# Altium schematic sheet Copy of STM32_F407.SchDoc.schdoc
size 576 x 409 mm
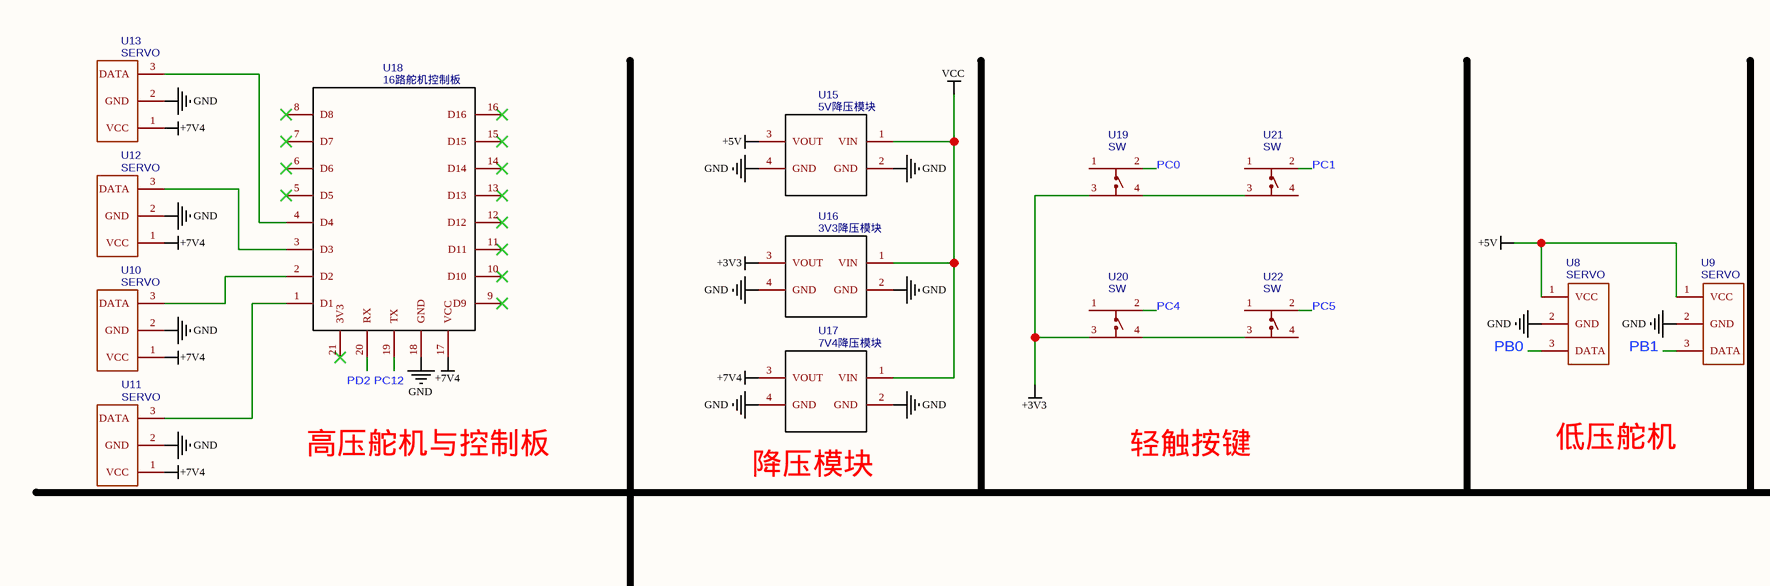
[diagram p0: Copy of STM32_F407.SchDoc.schdoc, top left]
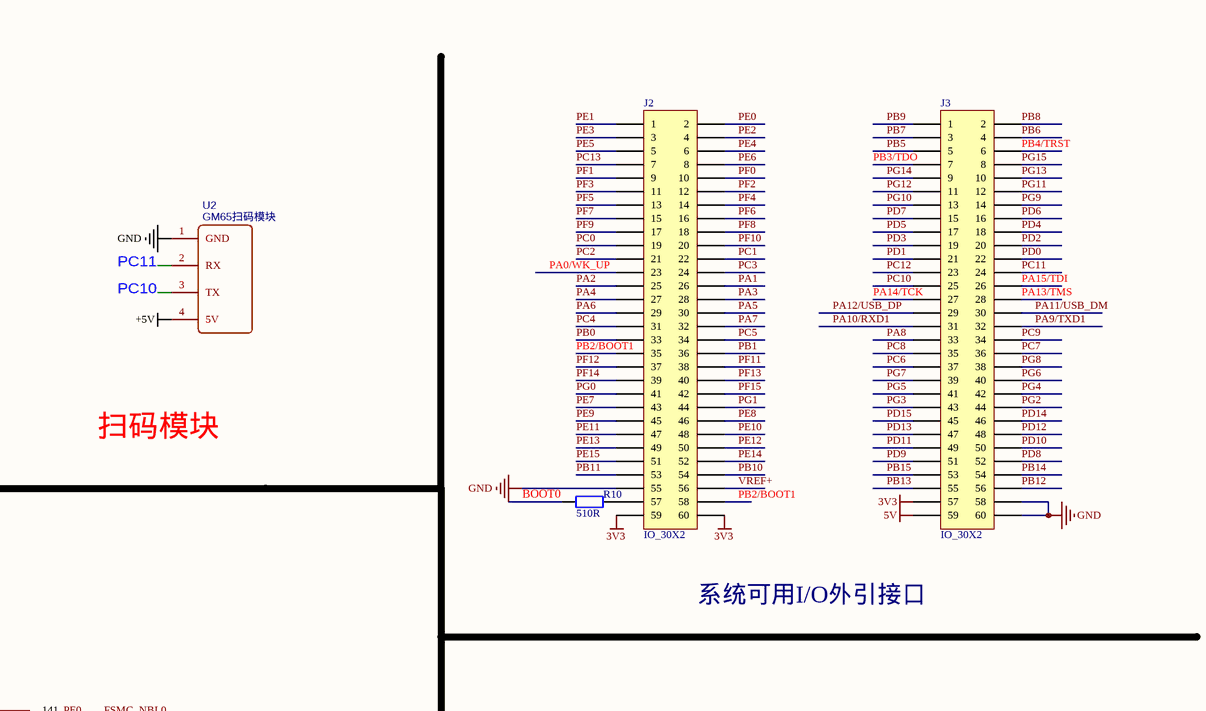
[diagram p1: Copy of STM32_F407.SchDoc.schdoc, top right]
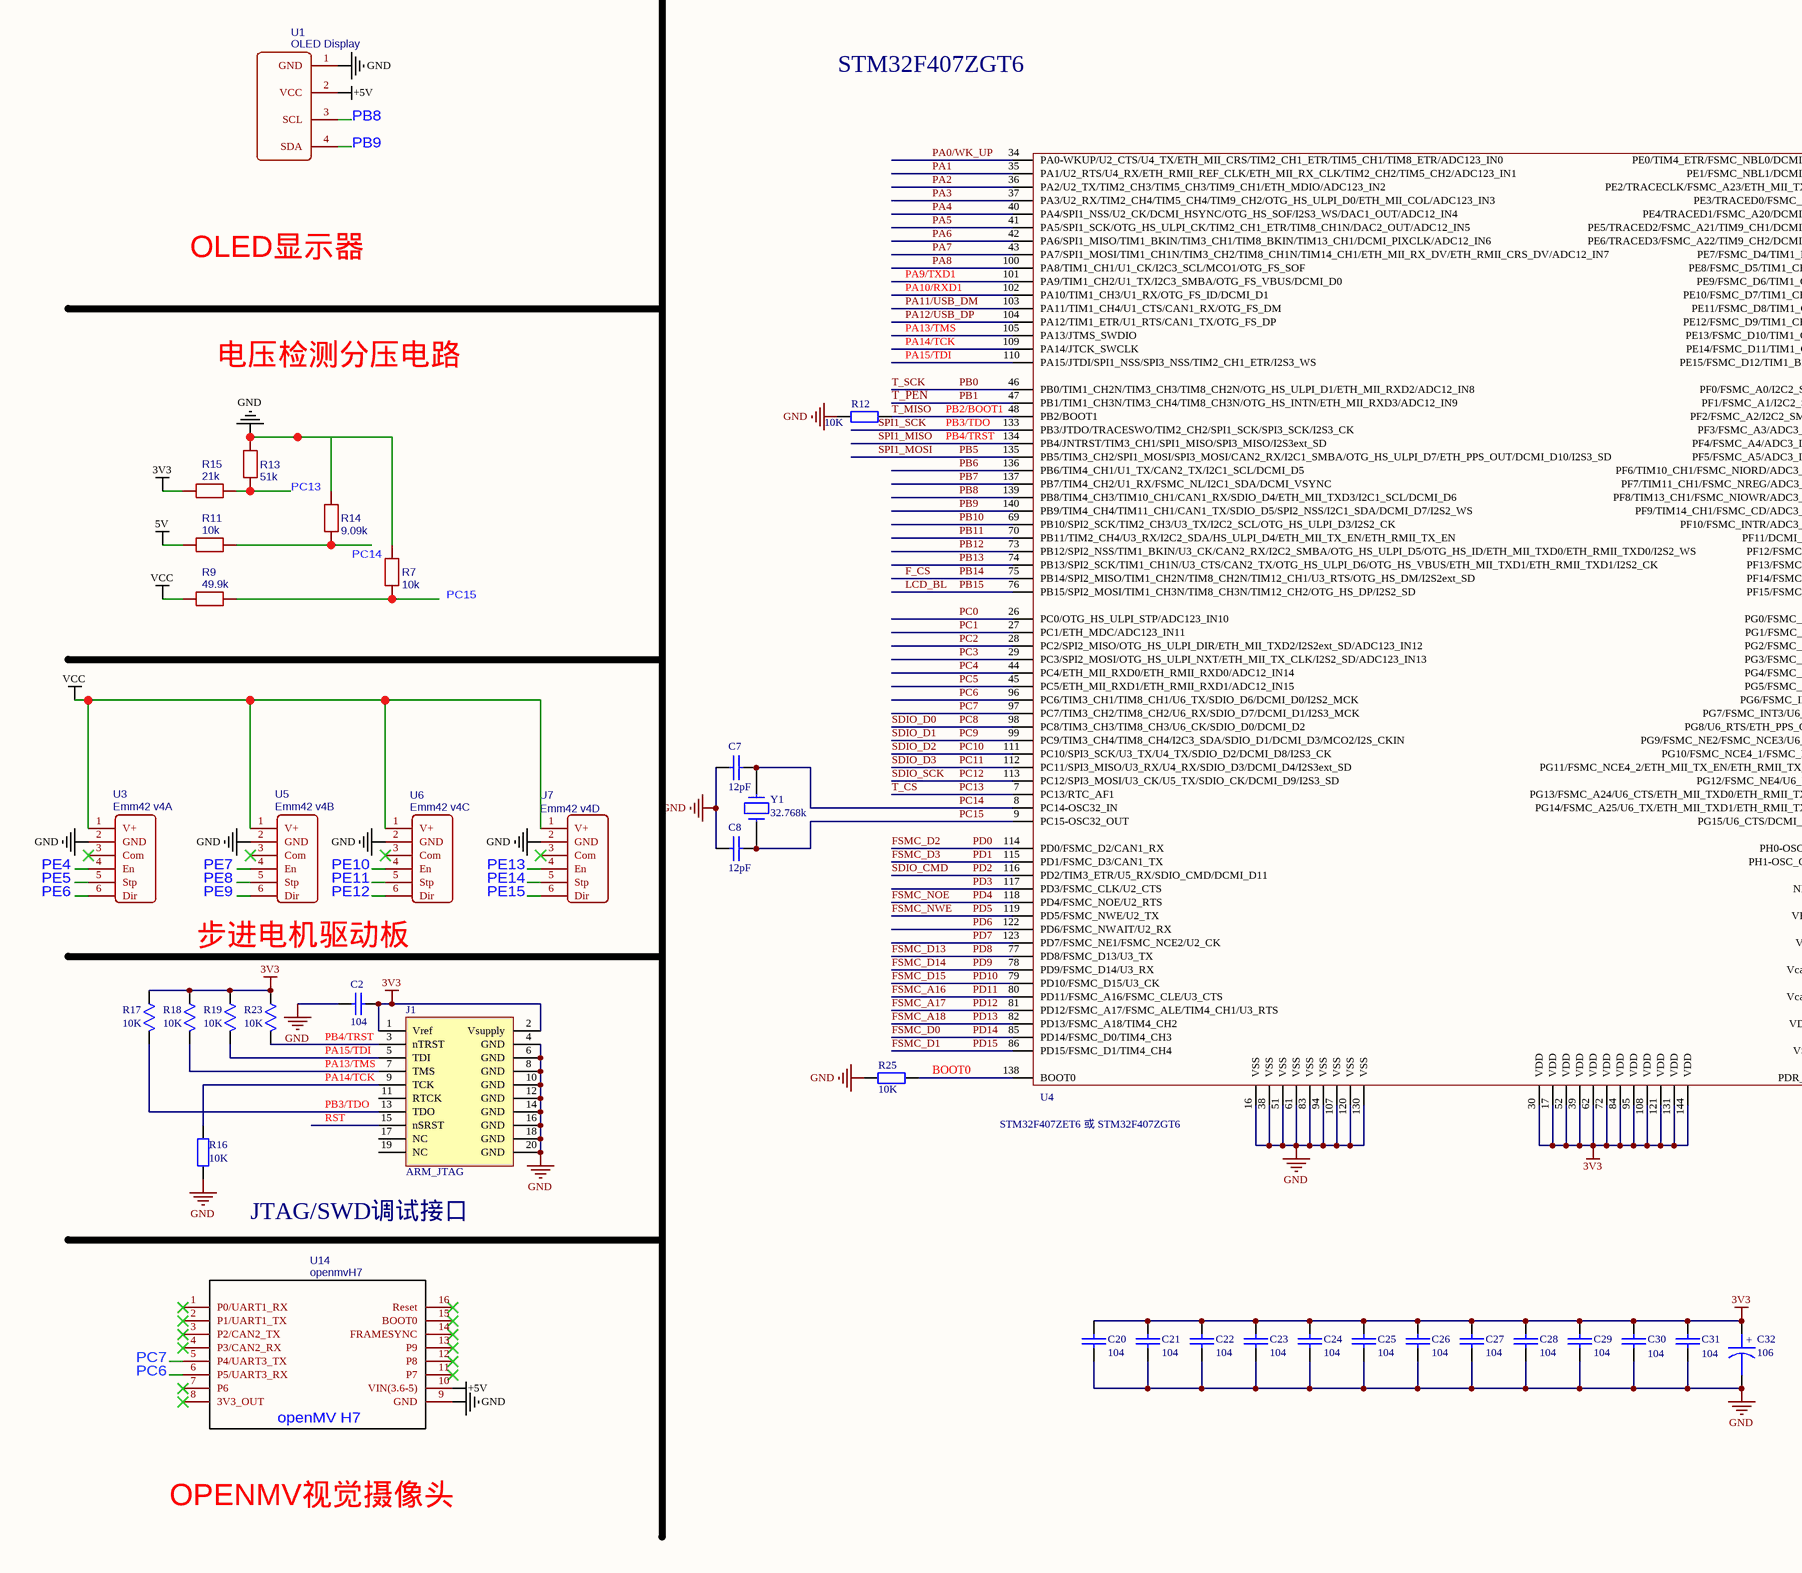
[diagram p2: Copy of STM32_F407.SchDoc.schdoc, bottom left]
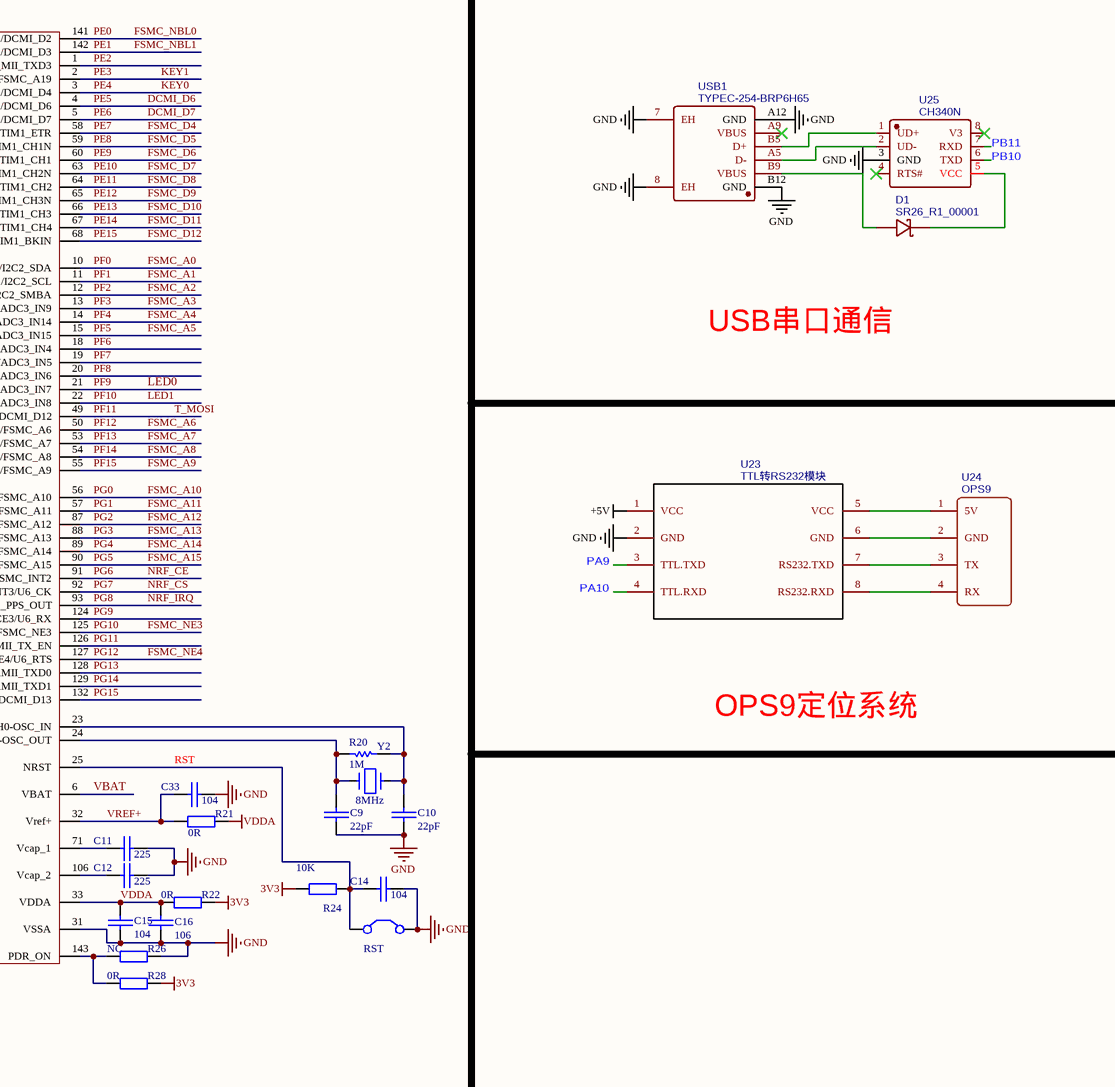
[diagram p3: Copy of STM32_F407.SchDoc.schdoc, bottom right]

## Parts
C2  NO  [RC0603]  (value not drawn)
C7  12pF  [RC0603]
C8  12pF  [RC0603]
C9  22pF  [RC0603]
C10  22pF  [RC0603]
C11  225  [RC0805]
C12  225  [RC0805]
C14  104  [RC0603]
C15  104  [RC0603]
C16  106  [RC0805]
C20  104  [RC0603]
C21  104  [RC0603]
C22  104  [RC0603]
C23  104  [RC0603]
C24  104  [RC0603]
C25  104  [RC0603]
C26  104  [RC0603]
C27  104  [RC0603]
C28  104  [RC0603]
C29  104  [RC0603]
C30  104  [RC0603]
C31  104  [RC0603]
C32  106  [RC0805]
C33  104  [RC0603]
D1  SR26_R1_00001  [SMA_L4.3-W2.6-LS5.2-RD]
J1  ARM_JTAG  [JTAG20P]
J2  IO_30X2  [IDE2X30]
J3  IO_30X2  [IDE2X30]
R7  10k  [R0805]
R9  49.9k  [R0805]
R10  510R  [RC0603]
R11  10k  [R0805]
R12  10K  [RC0603]
R13  51k  [R0805]
R14  9.09k  [R0603]
R15  21k  [R0603]
R16  10K  [RC0603]
R17  10K  [RC0603]
R18  10K  [RC0603]
R19  10K  [RC0603]
R20  1M  [RC0603]
R21  0R  [RC0603]
R22  0R  [RC0603]
R23  10K  [RC0603]
R24  10K  [RC0603]
R25  10K  [RC0603]
R26  NC  [RC0603]
R28  0R  [RC0603]
RST  Key  [KEY]  (value not drawn)
U1  OLED Display
U2  GM65扫码模块
U3  Emm42 v4A
U4  STM32F407ZET6 或 STM32F407ZGT6  [LQFP144N]
U5  Emm42 v4B
U6  Emm42 v4C
U7  Emm42 v4D
U8  SERVO
U9  SERVO
U10  SERVO
U11  SERVO
U12  SERVO
U13  SERVO
U14  openmvH7  [OPENMVH7]
U15  5V降压模块
U16  3V3降压模块
U17  7V4降压模块
U18  16路舵机控制板
U19  SW  [SW-SMD_4P-L6.0-W6.0-P4.50-LS9.0-2]
U20  SW  [SW-SMD_4P-L6.0-W6.0-P4.50-LS9.0-2]
U21  SW  [SW-SMD_4P-L6.0-W6.0-P4.50-LS9.0-2]
U22  SW  [SW-SMD_4P-L6.0-W6.0-P4.50-LS9.0-2]
U23  TTL转RS232模块
U24  OPS9
U25  CH340N  [SOP-8_L5.0-W4.0-P1.27-LS6.0-BL]
USB1  TYPEC-254-BRP6H65  [USB-C-SMD_TYPEC-254-BRP6H65]
Y1  8MHz  [32.768K]  (value not drawn)
Y2  8MHz  [SMD49S]

## Nets
3V3: C2.2 C20.1 C21.1 C22.1 C23.1 C24.1 C25.1 C26.1 C27.1 C28.1 C29.1 C30.1 C31.1 C32.1 J1.1(Vref) J1.2(Vsupply) J2.59 J2.60 J3.57 R15.1 R17.1 R18.1 R19.1 R22.2 R23.1 R24.2 R28.2 U4.17(VDD) U4.30(VDD) U4.39(VDD) U4.52(VDD) U4.62(VDD) U4.72(VDD) U4.84(VDD) U4.95(VDD) U4.108(VDD) U4.121(VDD) U4.131(VDD) U4.144(VDD)
5V: J3.59 R11.1
+3V3: U16.3(VOUT) U19.3(C) U20.3(C)
+5V: U1.2(VCC) U2.4(5V) U8.1(VCC) U9.1(VCC) U14.10(VIN(3.6-5)) U15.3(VOUT) U23.1(VCC)
+7V4: U10.1(VCC) U11.1(VCC) U12.1(VCC) U13.1(VCC) U17.3(VOUT) U18.17(VCC)
GND: C2.1 C7.1 C8.1 C9.2 C10.2 C11.2 C12.2 C14.1 C15.1 C16.1 C20.2 C21.2 C22.2 C23.2 C24.2 C25.2 C26.2 C27.2 C28.2 C29.2 C30.2 C31.2 C32.2 C33.2 J1.4(GND) J1.6(GND) J1.8(GND) J1.10(GND) J1.12(GND) J1.14(GND) J1.16(GND) J1.18(GND) J1.20(GND) J2.55 J3.58 J3.60 R7.2 R12.2 R13.2 R14.2 R16.1 R25.2 R26.2 RST.2(C2) U1.1(GND) U2.1(GND) U3.2(GND) U4.16(VSS) U4.31(VSSA) U4.38(VSS) U4.51(VSS) U4.61(VSS) U4.83(VSS) U4.94(VSS) U4.107(VSS) U4.120(VSS) U4.130(VSS) U5.2(GND) U6.2(GND) U7.2(GND) U8.2(GND) U9.2(GND) U10.2(GND) U11.2(GND) U12.2(GND) U13.2(GND) U14.9(GND) U15.2(GND) U15.4(GND) U16.2(GND) U16.4(GND) U17.2(GND) U17.4(GND) U18.18(GND) U23.2(GND) U25.3(GND) USB1.7(EH) USB1.8(EH) USB1.A12(GND) USB1.B12(GND)
VCC: R9.1 U3.1(V+) U5.1(V+) U6.1(V+) U7.1(V+) U15.1(VIN) U16.1(VIN) U17.1(VIN)
VDDA: C15.2 C16.2 R21.2 R22.1 U4.33(VDDA)
BOOT0: R10.2 R25.1 U4.138(BOOT0)
DCMI_D6: J2.5 U4.4(PE5/TRACED2/FSMC_A21/TIM9_CH1/DCMI_D6)  [also labelled PE5]
DCMI_D7: J2.8 U4.5(PE6/TRACED3/FSMC_A22/TIM9_CH2/DCMI_D7)  [also labelled PE6]
F_CS: J3.54 U4.75(PB14/SPI2_MISO/TIM1_CH2N/TIM8_CH2N/TIM12_CH1/U3_RTS/OTG_HS_DM/I2S2ext_SD)  [also labelled PB14]
FSMC_A0: J2.10 U4.10(PF0/FSMC_A0/I2C2_SDA)  [also labelled PF0]
FSMC_A1: J2.9 U4.11(PF1/FSMC_A1/I2C2_SCL)  [also labelled PF1]
FSMC_A2: J2.12 U4.12(PF2/FSMC_A2/I2C2_SMBA)  [also labelled PF2]
FSMC_A3: J2.11 U4.13(PF3/FSMC_A3/ADC3_IN9)  [also labelled PF3]
FSMC_A4: J2.14 U4.14(PF4/FSMC_A4/ADC3_IN14)  [also labelled PF4]
FSMC_A5: J2.13 U4.15(PF5/FSMC_A5/ADC3_IN15)  [also labelled PF5]
FSMC_A6: J2.37 U4.50(PF12/FSMC_A6)  [also labelled PF12]
FSMC_A7: J2.40 U4.53(PF13/FSMC_A7)  [also labelled PF13]
FSMC_A8: J2.39 U4.54(PF14/FSMC_A8)  [also labelled PF14]
FSMC_A9: J2.42 U4.55(PF15/FSMC_A9)  [also labelled PF15]
FSMC_A10: J2.41 U4.56(PG0/FSMC_A10)  [also labelled PG0]
FSMC_A11: J2.44 U4.57(PG1/FSMC_A11)  [also labelled PG1]
FSMC_A12: J3.44 U4.87(PG2/FSMC_A12)  [also labelled PG2]
FSMC_A13: J3.43 U4.88(PG3/FSMC_A13)  [also labelled PG3]
FSMC_A14: J3.42 U4.89(PG4/FSMC_A14)  [also labelled PG4]
FSMC_A15: J3.41 U4.90(PG5/FSMC_A15)  [also labelled PG5]
FSMC_A16: J3.49 U4.80(PD11/FSMC_A16/FSMC_CLE/U3_CTS)  [also labelled PD11]
FSMC_A17: J3.48 U4.81(PD12/FSMC_A17/FSMC_ALE/TIM4_CH1/U3_RTS)  [also labelled PD12]
FSMC_A18: J3.47 U4.82(PD13/FSMC_A18/TIM4_CH2)  [also labelled PD13]
FSMC_D0: J3.46 U4.85(PD14/FSMC_D0/TIM4_CH3)  [also labelled PD14]
FSMC_D1: J3.45 U4.86(PD15/FSMC_D1/TIM4_CH4)  [also labelled PD15]
FSMC_D2: J3.22 U4.114(PD0/FSMC_D2/CAN1_RX)  [also labelled PD0]
FSMC_D3: J3.21 U4.115(PD1/FSMC_D3/CAN1_TX)  [also labelled PD1]
FSMC_D4: J2.43 U4.58(PE7/FSMC_D4/TIM1_ETR)  [also labelled PE7]
FSMC_D5: J2.46 U4.59(PE8/FSMC_D5/TIM1_CH1N)  [also labelled PE8]
FSMC_D6: J2.45 U4.60(PE9/FSMC_D6/TIM1_CH1)  [also labelled PE9]
FSMC_D7: J2.48 U4.63(PE10/FSMC_D7/TIM1_CH2N)  [also labelled PE10]
FSMC_D8: J2.47 U4.64(PE11/FSMC_D8/TIM1_CH2)  [also labelled PE11]
FSMC_D9: J2.50 U4.65(PE12/FSMC_D9/TIM1_CH3N)  [also labelled PE12]
FSMC_D10: J2.49 U4.66(PE13/FSMC_D10/TIM1_CH3)  [also labelled PE13]
FSMC_D11: J2.52 U4.67(PE14/FSMC_D11/TIM1_CH4)  [also labelled PE14]
FSMC_D12: J2.51 U4.68(PE15/FSMC_D12/TIM1_BKIN)  [also labelled PE15]
FSMC_D13: J3.52 U4.77(PD8/FSMC_D13/U3_TX)  [also labelled PD8]
FSMC_D14: J3.51 U4.78(PD9/FSMC_D14/U3_RX)  [also labelled PD9]
FSMC_D15: J3.50 U4.79(PD10/FSMC_D15/U3_CK)  [also labelled PD10]
FSMC_NBL0: J2.2 U4.141(PE0/TIM4_ETR/FSMC_NBL0/DCMI_D2)  [also labelled PE0]
FSMC_NBL1: J2.1 U4.142(PE1/FSMC_NBL1/DCMI_D3)  [also labelled PE1]
FSMC_NE3: J3.13 U4.125(PG10/FSMC_NCE4_1/FSMC_NE3)  [also labelled PG10]
FSMC_NE4: J3.11 U4.127(PG12/FSMC_NE4/U6_RTS)  [also labelled PG12]
FSMC_NOE: J3.18 U4.118(PD4/FSMC_NOE/U2_RTS)  [also labelled PD4]
FSMC_NWE: J3.17 U4.119(PD5/FSMC_NWE/U2_TX)  [also labelled PD5]
KEY0: J2.6 U4.3(PE4/TRACED1/FSMC_A20/DCMI_D4)  [also labelled PE4]
KEY1: J2.3 U4.2(PE3/TRACED0/FSMC_A19)  [also labelled PE3]
LCD_BL: J3.53 U4.76(PB15/SPI2_MOSI/TIM1_CH3N/TIM8_CH3N/TIM12_CH2/OTG_HS_DP/I2S2_SD)  [also labelled PB15]
LED0: J2.17 U4.21(PF9/TIM14_CH1/FSMC_CD/ADC3_IN7)  [also labelled PF9]
LED1: J2.20 U4.22(PF10/FSMC_INTR/ADC3_IN8)  [also labelled PF10]
NRF_CE: J3.40 U4.91(PG6/FSMC_INT2)  [also labelled PG6]
NRF_CS: J3.39 U4.92(PG7/FSMC_INT3/U6_CK)  [also labelled PG7]
NRF_IRQ: J3.38 U4.93(PG8/U6_RTS/ETH_PPS_OUT)  [also labelled PG8]
PA0/WK_UP: J2.23 U4.34(PA0-WKUP/U2_CTS/U4_TX/ETH_MII_CRS/TIM2_CH1_ETR/TIM5_CH1/TIM8_ETR/ADC123_IN0)
PA1: J2.26 U4.35(PA1/U2_RTS/U4_RX/ETH_RMII_REF_CLK/ETH_MII_RX_CLK/TIM2_CH2/TIM5_CH2/ADC123_IN1)
PA2: J2.25 U4.36(PA2/U2_TX/TIM2_CH3/TIM5_CH3/TIM9_CH1/ETH_MDIO/ADC123_IN2)
PA3: J2.28 U4.37(PA3/U2_RX/TIM2_CH4/TIM5_CH4/TIM9_CH2/OTG_HS_ULPI_D0/ETH_MII_COL/ADC123_IN3)
PA4: J2.27 U4.40(PA4/SPI1_NSS/U2_CK/DCMI_HSYNC/OTG_HS_SOF/I2S3_WS/DAC1_OUT/ADC12_IN4)
PA5: J2.30 U4.41(PA5/SPI1_SCK/OTG_HS_ULPI_CK/TIM2_CH1_ETR/TIM8_CH1N/DAC2_OUT/ADC12_IN5)
PA6: J2.29 U4.42(PA6/SPI1_MISO/TIM1_BKIN/TIM3_CH1/TIM8_BKIN/TIM13_CH1/DCMI_PIXCLK/ADC12_IN6)
PA7: J2.32 U4.43(PA7/SPI1_MOSI/TIM1_CH1N/TIM3_CH2/TIM8_CH1N/TIM14_CH1/ETH_MII_RX_DV/ETH_RMII_CRS_DV/ADC12_IN7)
PA8: J3.33 U4.100(PA8/TIM1_CH1/U1_CK/I2C3_SCL/MCO1/OTG_FS_SOF)
PA9/TXD1: J3.32 U4.101(PA9/TIM1_CH2/U1_TX/I2C3_SMBA/OTG_FS_VBUS/DCMI_D0)
PA10/RXD1: J3.31 U4.102(PA10/TIM1_CH3/U1_RX/OTG_FS_ID/DCMI_D1)
PA11/USB_DM: J3.30 U4.103(PA11/TIM1_CH4/U1_CTS/CAN1_RX/OTG_FS_DM)
PA12/USB_DP: J3.29 U4.104(PA12/TIM1_ETR/U1_RTS/CAN1_TX/OTG_FS_DP)
PA13/TMS: J1.7(TMS) J3.28 R18.2 U4.105(PA13/JTMS_SWDIO)
PA14/TCK: J1.9(TCK) J3.27 R16.2 U4.109(PA14/JTCK_SWCLK)
PA15/TDI: J1.5(TDI) J3.26 R19.2 U4.110(PA15/JTDI/SPI1_NSS/SPI3_NSS/TIM2_CH1_ETR/I2S3_WS)
PB0: J2.33 U4.46(PB0/TIM1_CH2N/TIM3_CH3/TIM8_CH2N/OTG_HS_ULPI_D1/ETH_MII_RXD2/ADC12_IN8)  [also labelled T_SCK]
PB1: J2.36 U4.47(PB1/TIM1_CH3N/TIM3_CH4/TIM8_CH3N/OTG_HS_INTN/ETH_MII_RXD3/ADC12_IN9)  [also labelled T_PEN]
PB2/BOOT1: J2.35 J2.58 R12.1 U4.48(PB2/BOOT1)  [also labelled T_MISO]
PB3/TDO: J1.13(TDO) J3.7 R17.2 U4.133(PB3/JTDO/TRACESWO/TIM2_CH2/SPI1_SCK/SPI3_SCK/I2S3_CK)  [also labelled SPI1_SCK]
PB4/TRST: J1.3(nTRST) J3.6 R23.2 U4.134(PB4/JNTRST/TIM3_CH1/SPI1_MISO/SPI3_MISO/I2S3ext_SD)  [also labelled SPI1_MISO]
PB5: J3.5 U4.135(PB5/TIM3_CH2/SPI1_MOSI/SPI3_MOSI/CAN2_RX/I2C1_SMBA/OTG_HS_ULPI_D7/ETH_PPS_OUT/DCMI_D10/I2S3_SD)  [also labelled SPI1_MOSI]
PB6: J3.4 U4.136(PB6/TIM4_CH1/U1_TX/CAN2_TX/I2C1_SCL/DCMI_D5)
PB7: J3.3 U4.137(PB7/TIM4_CH2/U1_RX/FSMC_NL/I2C1_SDA/DCMI_VSYNC)
PB8: J3.2 U4.139(PB8/TIM4_CH3/TIM10_CH1/CAN1_RX/SDIO_D4/ETH_MII_TXD3/I2C1_SCL/DCMI_D6)
PB9: J3.1 U4.140(PB9/TIM4_CH4/TIM11_CH1/CAN1_TX/SDIO_D5/SPI2_NSS/I2C1_SDA/DCMI_D7/I2S2_WS)
PB10: J2.54 U4.69(PB10/SPI2_SCK/TIM2_CH3/U3_TX/I2C2_SCL/OTG_HS_ULPI_D3/I2S2_CK)
PB11: J2.53 U4.70(PB11/TIM2_CH4/U3_RX/I2C2_SDA/HS_ULPI_D4/ETH_MII_TX_EN/ETH_RMII_TX_EN)
PB12: J3.56 U4.73(PB12/SPI2_NSS/TIM1_BKIN/U3_CK/CAN2_RX/I2C2_SMBA/OTG_HS_ULPI_D5/OTG_HS_ID/ETH_MII_TXD0/ETH_RMII_TXD0/I2S2_WS)
PB13: J3.55 U4.74(PB13/SPI2_SCK/TIM1_CH1N/U3_CTS/CAN2_TX/OTG_HS_ULPI_D6/OTG_HS_VBUS/ETH_MII_TXD1/ETH_RMII_TXD1/I2S2_CK)
PC0: J2.19 U4.26(PC0/OTG_HS_ULPI_STP/ADC123_IN10)
PC1: J2.22 U4.27(PC1/ETH_MDC/ADC123_IN11)
PC2: J2.21 U4.28(PC2/SPI2_MISO/OTG_HS_ULPI_DIR/ETH_MII_TXD2/I2S2ext_SD/ADC123_IN12)
PC3: J2.24 U4.29(PC3/SPI2_MOSI/OTG_HS_ULPI_NXT/ETH_MII_TX_CLK/I2S2_SD/ADC123_IN13)
PC4: J2.31 U4.44(PC4/ETH_MII_RXD0/ETH_RMII_RXD0/ADC12_IN14)
PC5: J2.34 U4.45(PC5/ETH_MII_RXD1/ETH_RMII_RXD1/ADC12_IN15)
PC6: J3.37 U4.96(PC6/TIM3_CH1/TIM8_CH1/U6_TX/SDIO_D6/DCMI_D0/I2S2_MCK)
PC7: J3.36 U4.97(PC7/TIM3_CH2/TIM8_CH2/U6_RX/SDIO_D7/DCMI_D1/I2S3_MCK)
PC8: J3.35 U4.98(PC8/TIM3_CH3/TIM8_CH3/U6_CK/SDIO_D0/DCMI_D2)  [also labelled SDIO_D0]
PC9: J3.34 U4.99(PC9/TIM3_CH4/TIM8_CH4/I2C3_SDA/SDIO_D1/DCMI_D3/MCO2/I2S_CKIN)  [also labelled SDIO_D1]
PC10: J3.25 U4.111(PC10/SPI3_SCK/U3_TX/U4_TX/SDIO_D2/DCMI_D8/I2S3_CK)  [also labelled SDIO_D2]
PC11: J3.24 U4.112(PC11/SPI3_MISO/U3_RX/U4_RX/SDIO_D3/DCMI_D4/I2S3ext_SD)  [also labelled SDIO_D3]
PC12: J3.23 U4.113(PC12/SPI3_MOSI/U3_CK/U5_TX/SDIO_CK/DCMI_D9/I2S3_SD)  [also labelled SDIO_SCK]
PC13: J2.7 U4.7(PC13/RTC_AF1)  [also labelled T_CS]
PC14: C7.2 U4.8(PC14-OSC32_IN) Y1.2
PC15: C8.2 U4.9(PC15-OSC32_OUT) Y1.1
PD2: J3.20 U4.116(PD2/TIM3_ETR/U5_RX/SDIO_CMD/DCMI_D11)  [also labelled SDIO_CMD]
PD3: J3.19 U4.117(PD3/FSMC_CLK/U2_CTS)
PD6: J3.16 U4.122(PD6/FSMC_NWAIT/U2_RX)
PD7: J3.15 U4.123(PD7/FSMC_NE1/FSMC_NCE2/U2_CK)
PE2: J2.4 U4.1(PE2/TRACECLK/FSMC_A23/ETH_MII_TXD3)
PF6: J2.16 U4.18(PF6/TIM10_CH1/FSMC_NIORD/ADC3_IN4)
PF7: J2.15 U4.19(PF7/TIM11_CH1/FSMC_NREG/ADC3_IN5)
PF8: J2.18 U4.20(PF8/TIM13_CH1/FSMC_NIOWR/ADC3_IN6)
PF11: J2.38 U4.49(PF11/DCMI_D12)  [also labelled T_MOSI]
PG9: J3.14 U4.124(PG9/FSMC_NE2/FSMC_NCE3/U6_RX)
PG11: J3.12 U4.126(PG11/FSMC_NCE4_2/ETH_MII_TX_EN/ETH_RMII_TX_EN)
PG13: J3.10 U4.128(PG13/FSMC_A24/U6_CTS/ETH_MII_TXD0/ETH_RMII_TXD0)
PG14: J3.9 U4.129(PG14/FSMC_A25/U6_TX/ETH_MII_TXD1/ETH_RMII_TXD1)
PG15: J3.8 U4.132(PG15/U6_CTS/DCMI_D13)
RST: C14.2 J1.15(nSRST) R24.1 RST.1(C1) U4.25(NRST)
VBAT: U4.6(VBAT)
VREF+: C33.1 J2.56 R21.1 U4.32(Vref+)
NetC9_1: C9.1 R20.2 U4.24(PH1-OSC_OUT) Y2.2
NetC10_1: C10.1 R20.1 U4.23(PH0-OSC_IN) Y2.1
NetC11_1: C11.1 U4.71(Vcap_1)
NetC12_1: C12.1 U4.106(Vcap_2)
NetD1_1: D1.1 U25.5(VCC)
NetD1_2: D1.2 USB1.B9(VBUS)
NetJ2_57: J2.57 R10.1
NetR7_1: R7.1 R9.2
NetR11_2: R11.2 R14.1
NetR13_1: R13.1 R15.2
NetR26_1: R26.1 R28.1 U4.143(PDR_ON)
NetU10_3: U10.3(DATA) U18.2(D2)
NetU11_3: U11.3(DATA) U18.1(D1)
NetU12_3: U12.3(DATA) U18.3(D3)
NetU13_3: U13.3(DATA) U18.4(D4)
NetU19_4: U19.4(D) U21.3(C)
NetU20_4: U20.4(D) U22.3(C)
NetU23_5: U23.5(VCC) U24.1(5V)
NetU23_6: U23.6(GND) U24.2(GND)
NetU23_7: U23.7(RS232.TXD) U24.3(TX)
NetU23_8: U23.8(RS232.RXD) U24.4(RX)
NetU25_1: U25.1(UD+) USB1.B5(D+)
NetU25_2: U25.2(UD-) USB1.A5(D-)

Not connected (* = marked no-connect by the designer): J1 11(RTCK) 17(NC) 19(NC); U1 3(SCL) 4(SDA); U2 2(RX) 3(TX); U3 3(Com)* 4(En) 5(Stp) 6(Dir); U5 3(Com)* 4(En) 5(Stp) 6(Dir); U6 3(Com)* 4(En) 5(Stp) 6(Dir); U7 3(Com)* 4(En) 5(Stp) 6(Dir); U8 3(DATA); U9 3(DATA); U14 1(P0/UART1_RX)* 2(P1/UART1_TX)* 3(P2/CAN2_TX)* 4(P3/CAN2_RX)* 5(P4/UART3_TX) 6(P5/UART3_RX) 7(P6)* 8(3V3_OUT)* 11(P7)* 12(P8)* 13(P9)* 14(FRAMESYNC)* 15(BOOT0)* 16(Reset)*; U18 5(D5)* 6(D6)* 7(D7)* 8(D8)* 9(D9)* 10(D10)* 11(D11)* 12(D12)* 13(D13)* 14(D14)* 15(D15)* 16(D16)* 19(TX) 20(RX) 21(3V3)*; U19 1(A) 2(B); U20 1(A) 2(B); U21 1(A) 2(B) 4(D); U22 1(A) 2(B) 4(D); U23 3(TTL.TXD) 4(TTL.RXD); U25 4(RTS#)* 6(TXD) 7(RXD) 8(V3)*; USB1 A9(VBUS)*

## Notes on the sheet
- (near U19) PC0
- (near U21) PC1
- (near U2) PC11
- (near U20) PC4
- (near U22) PC5
- (near U8) PB0
- PB1
- (near U2) PC10
- (near U18) PD2
- (near U18) PC12
- 高压舵机与控制板
- (near U17) 降压模块
- 轻触按键
- 低压舵机
- 扫码模块
- 系统可用I/O外引接口
- (near U1) PB8
- STM32F407ZGT6
- (near U1) PB9
- OLED显示器
- (near U25) PB11
- (near U25) PB10
- 电压检测分压电路
- USB串口通信
- (near R14) PC13
- PC14
- PC15
- (near U23) PA10
- (near U23) PA9
- (near U3) PE4
- (near U5) PE7
- PE10
- PE13
- OPS9定位系统
- (near U3) PE5
- (near U3) PE6
- (near U5) PE8
- (near U5) PE9
- PE11
- PE12
- PE14
- PE15
- (near U5) 步进电机驱动板
- JTAG/SWD调试接口
- (near U14) PC7
- (near U14) PC6
- OPENMV视觉摄像头
- (in symbol 8MHz) 32.768k
- (in symbol 106) +
- (in symbol NO) 104
- (in symbol openmvH7) openMV H7

## Library data of the parts
D1 = SR26_R1_00001: Manufacturer: PANJIT(强茂); Contributor: LCSC; Supplier: LCSC; Supplier Part: C391711; Manufacturer Part: SR26_R1_00001; JLCPCB Part Class: Extended Part; link: https://so.szlcsc.com/global.html?k=C391711&ref=editor; spicePre: D; spiceSymbolName: SR26_R1_00001
R7 R11 = 10k: nameAlias: Value(Ω); Contributor: LCEDA_Lib; spicePre: R; spiceSymbolName: R_0805_EU
R9 = 49.9k: nameAlias: Value(Ω); Contributor: LCEDA_Lib; spicePre: R; spiceSymbolName: R_0805_EU
R13 = 51k: nameAlias: Value(Ω); Contributor: LCEDA_Lib; spicePre: R; spiceSymbolName: R_0805_EU
R14 = 9.09k: nameAlias: Value(Ω); Contributor: LCEDA_Lib; spicePre: R; spiceSymbolName: R_0603_EU
R15 = 21k: nameAlias: Value(Ω); Contributor: LCEDA_Lib; spicePre: R; spiceSymbolName: R_0603_EU
U1 = OLED Display: Contributor: mac149; spicePre: U; spiceSymbolName: OLED Display
U2 = GM65扫码模块: Contributor: mac149; spicePre: U; spiceSymbolName: GM65
U3 = Emm42 v4A: Contributor: mac149; spicePre: U; spiceSymbolName: Emm42 v4
U5 = Emm42 v4B: Contributor: mac149; spicePre: U; spiceSymbolName: Emm42 v4
U6 = Emm42 v4C: Contributor: mac149; spicePre: U; spiceSymbolName: Emm42 v4
U7 = Emm42 v4D: Contributor: mac149; spicePre: U; spiceSymbolName: Emm42 v4
U8-U13 = SERVO: Contributor: mac149; spicePre: U; spiceSymbolName: SERVO
U14 = openmvH7: Contributor: xinb; spicePre: U; spiceSymbolName: openmvH7
U15 = 5V降压模块: Contributor: mac149; spicePre: U; spiceSymbolName: 降压模块
U16 = 3V3降压模块: Contributor: mac149; spicePre: U; spiceSymbolName: 降压模块
U17 = 7V4降压模块: Contributor: mac149; spicePre: U; spiceSymbolName: 降压模块
U18 = 16路舵机控制板: Contributor: mac149; spicePre: U; spiceSymbolName: 16路舵机控制板
U19-U22 = SW: Manufacturer: DEALON(德艺隆); Manufacturer Part: TD-1806SR-5.5H-250; Contributor: lcsc; Supplier: LCSC; Supplier Part: C18185743; link: https://so.szlcsc.com/global.html?k=C18185743&ref=editor; spicePre: U; spiceSymbolName: TD-1806SR-5.5H-250
U23 = TTL转RS232模块: Contributor: mac149; spicePre: U; spiceSymbolName: TTL转RS232模块
U24 = OPS9: Contributor: mac149; spicePre: U; spiceSymbolName: GM65
U25 = CH340N: Manufacturer: WCH(南京沁恒); Contributor: LCSC; Supplier: LCSC; Supplier Part: C506813; Manufacturer Part: CH340N; JLCPCB Part Class: Extended Part; link: https://so.szlcsc.com/global.html?k=C506813&ref=editor; spicePre: U; spiceSymbolName: CH340N
USB1 = TYPEC-254-BRP6H65: Manufacturer: XUNPU(讯普); Contributor: LCSC; Supplier: LCSC; Supplier Part: C2840385; Manufacturer Part: TYPEC-254-BRP6H65; JLCPCB Part Class: Extended Part; link: https://so.szlcsc.com/global.html?k=C2840385&ref=editor; spicePre: U; spiceSymbolName: TYPEC-254-BRP6H65
C2 = NO: Published: 8-Jun-2000; LatestRevisionDate: 17-Jul-2002; LatestRevisionNote: Re-released for DXP Platform.; PackageReference: RAD-0.3; Publisher: Altium Limited
J2 J3 = IO_30X2: LatestRevisionDate: 17-Jul-2002; LatestRevisionNote: Re-released for DXP Platform.; Publisher: Altium Limited
RST = Key: Published: 24-Mar-1999; LatestRevisionDate: 17-Jul-2002; LatestRevisionNote: Re-released for DXP Platform.; PackageReference: RAD-0.2; Publisher: Altium Limited